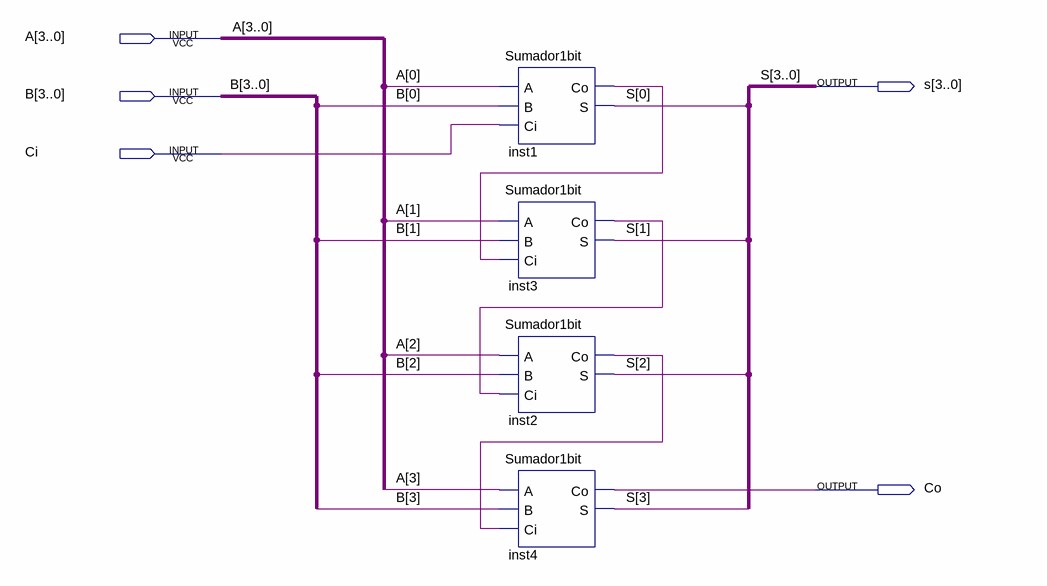
[diagram p0: schematic sheet]
// Quartus schematic Sum4bits.bdf as structural Verilog: 4 symbols, 5 pins
module Sum4bits (
  input  [3:0] A,
  input  [3:0] B,
  input  Ci,
  output [3:0] s,
  output Co
);

  wire inst1_co, inst2_co, inst3_co;

  Sumador1bit inst1 (.A(A[0]), .B(B[0]), .Ci(Ci), .Co(inst1_co), .S(s[0]));
  Sumador1bit inst3 (.A(A[1]), .B(B[1]), .Ci(inst1_co), .Co(inst3_co), .S(s[1]));
  Sumador1bit inst2 (.A(A[2]), .B(B[2]), .Ci(inst3_co), .Co(inst2_co), .S(s[2]));
  Sumador1bit inst4 (.A(A[3]), .B(B[3]), .Ci(inst2_co), .Co(Co), .S(s[3]));
endmodule
